# EAGLE design PDM (EAGLE 6.5.0)
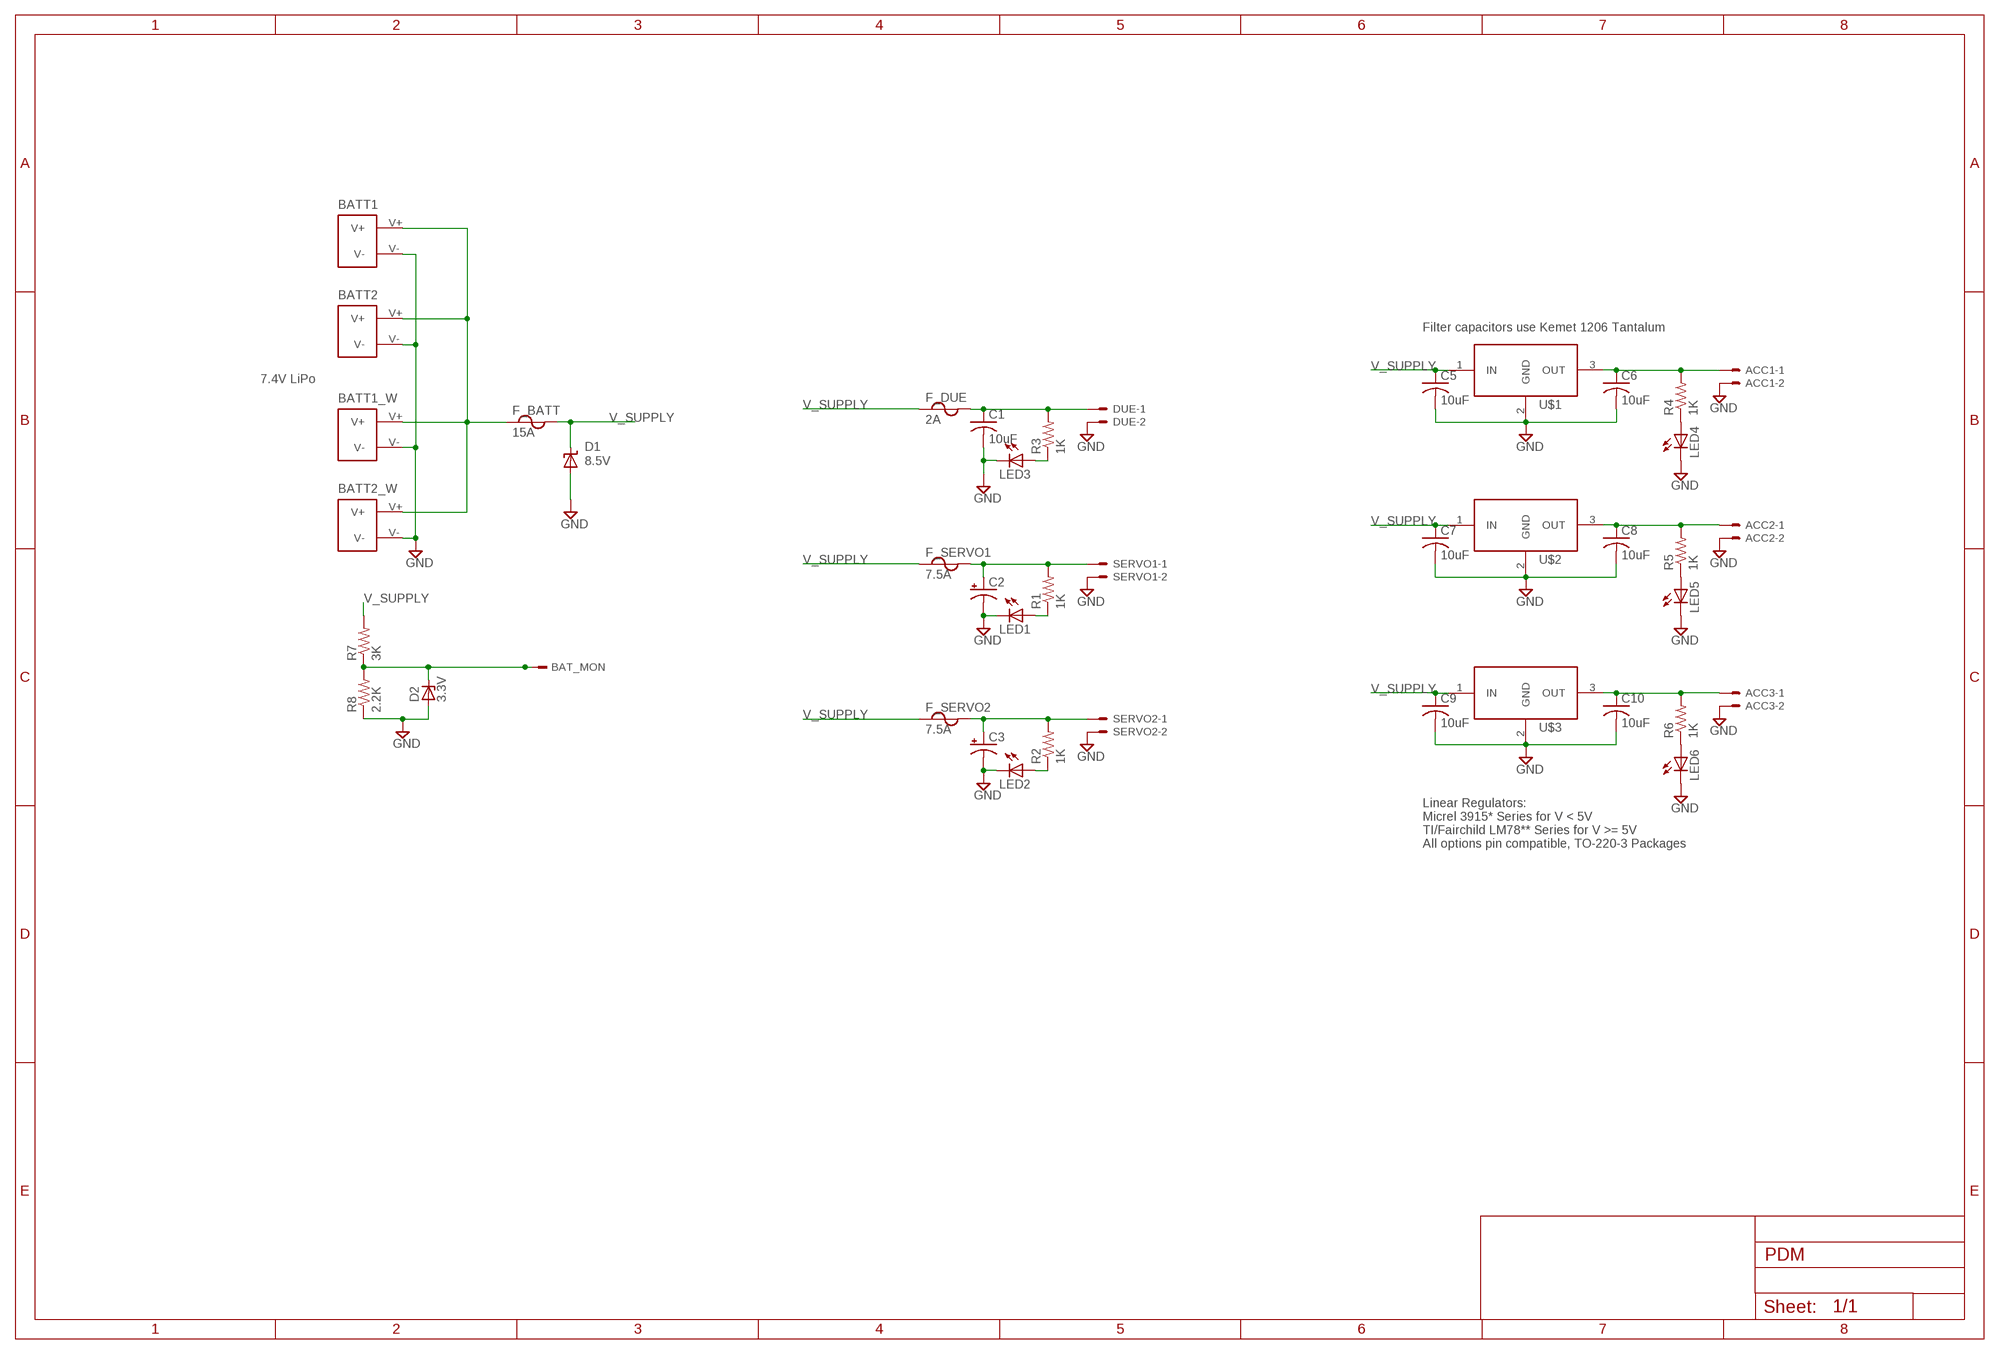
[diagram p0: schematic, sheet 1]

## Parts
ACC1  5566-2  [5566-2]
ACC2  5566-2  [5566-2]
ACC3  5566-2  [5566-2]
BAT_MON  TSW-101-02-S-S  [TSW-101-02-S-S]
BATT1  CON_XT60-PCB_MOUNT  [CON_XT60_PCB_MOUNT]
BATT1_W  CON_XT60-PIGTAIL  [CON_XT60_PIGTAIL]
BATT2  CON_XT60-PCB_MOUNT  [CON_XT60_PCB_MOUNT]
BATT2_W  CON_XT60-PIGTAIL  [CON_XT60_PIGTAIL]
C1  10uF  C-USC1206K  [C1206K]
C2  CPOL-USTT5D11  [TT5D11]
C3  CPOL-USTT5D11  [TT5D11]
C5  10uF  C-USC1206K  [C1206K]
C6  10uF  C-USC1206K  [C1206K]
C7  10uF  C-USC1206K  [C1206K]
C8  10uF  C-USC1206K  [C1206K]
C9  10uF  C-USC1206K  [C1206K]
C10  10uF  C-USC1206K  [C1206K]
D1  8.5V  SUPPRESSOR-SMBJ  [SMBJ]
D2  3.3V  ZENER-DIODESMB  [SMB]
DUE  5566-2  [5566-2]
F_BATT  15A  FUSE-ATO  [ATO]
F_DUE  2A  FUSE-ATO  [ATO]
F_SERVO1  7.5A  FUSE-ATO  [ATO]
F_SERVO2  7.5A  FUSE-ATO  [ATO]
LED1  LEDSML1206  [SML1206]
LED2  LEDSML1206  [SML1206]
LED3  LEDSML1206  [SML1206]
LED4  LEDSML1206  [SML1206]
LED5  LEDSML1206  [SML1206]
LED6  LEDSML1206  [SML1206]
R1  1K  R-US_R1206  [R1206]
R2  1K  R-US_R1206  [R1206]
R3  1K  R-US_R1206  [R1206]
R4  1K  R-US_R1206  [R1206]
R5  1K  R-US_R1206  [R1206]
R6  1K  R-US_R1206  [R1206]
R7  3K  R-US_R1206  [R1206]
R8  2.2K  R-US_R1206  [R1206]
SERVO1  5566-2  [5566-2]
SERVO2  5566-2  [5566-2]
U$1  MIC29150/29300/29500VERTICAL  [TO220V]
U$2  MIC29150/29300/29500VERTICAL  [TO220V]
U$3  MIC29150/29300/29500VERTICAL  [TO220V]

## Nets
GND: ACC1.2 ACC2.2 ACC3.2 BATT1.V- BATT1_W.V- BATT2.V- BATT2_W.V- C1.2 C2.- C3.- C5.2 C6.2 C7.2 C8.2 C9.2 C10.2 D1.A D2.A DUE.2 LED1.C LED2.C LED3.C LED4.C LED5.C LED6.C R8.1 SERVO1.2 SERVO2.2 U$1.2(GND) U$2.2(GND) U$3.2(GND)
N$1: C3.+ F_SERVO2.B1 F_SERVO2.B2 F_SERVO2.B3 F_SERVO2.B4 R2.2 SERVO2.1
N$2: BATT1.V+ BATT1_W.V+ BATT2.V+ BATT2_W.V+ F_BATT.A1 F_BATT.A2 F_BATT.A3 F_BATT.A4
N$4: C1.1 DUE.1 F_DUE.B1 F_DUE.B2 F_DUE.B3 F_DUE.B4 R3.2
N$5: LED1.A R1.1
N$6: ACC1.1 C6.1 R4.2 U$1.3(OUT)
N$8: LED2.A R2.1
N$9: ACC2.1 C8.1 R5.2 U$2.3(OUT)
N$11: LED3.A R3.1
N$13: LED4.A R4.1
N$15: C2.+ F_SERVO1.B1 F_SERVO1.B2 F_SERVO1.B3 F_SERVO1.B4 R1.2 SERVO1.1
N$16: LED5.A R5.1
N$18: BAT_MON.1 D2.C R7.1 R8.2
N$19: ACC3.1 C10.1 R6.2 U$3.3(OUT)
N$22: LED6.A R6.1
V_SUPPLY: C5.1 C7.1 C9.1 D1.C F_BATT.B1 F_BATT.B2 F_BATT.B3 F_BATT.B4 F_DUE.A1 F_DUE.A2 F_DUE.A3 F_DUE.A4 F_SERVO1.A1 F_SERVO1.A2 F_SERVO1.A3 F_SERVO1.A4 F_SERVO2.A1 F_SERVO2.A2 F_SERVO2.A3 F_SERVO2.A4 R7.2 U$1.1(IN) U$2.1(IN) U$3.1(IN)

## Notes on the sheet
- Filter capacitors use Kemet 1206 Tantalum
- 7.4V LiPo
- Linear Regulators:
  Micrel 3915* Series for V < 5V
  TI/Fairchild LM78** Series for V >= 5V
  All options pin compatible, TO-220-3 Packages

## Library data of the parts
ACC1-ACC3 DUE SERVO1 SERVO2 = con-molex:5566-2: Mini FIT connector 2 pol Source: http://www.molex.com; OC_FARNELL: 1822072; OC_NEWARK: unknown
BAT_MON = con-samtec:TSW-101-02-S-S: THROUGH-HOLE .025" SQ POST HEADER Source: Samtec TSW.pdf; OC_FARNELL: unknown; OC_NEWARK: unknown
BATT1 BATT1_W BATT2 BATT2_W = MRSDTeamB:CON_XT60-
C1 C5-C10 = rcl:C-US: CAPACITOR, American symbol
C2 C3 = rcl:CPOL-US: POLARIZED CAPACITOR, American symbol
D1 = MRSDTeamB:SUPPRESSOR-: Suppressor diode
D2 = diode:ZENER-DIODE: Z-Diode
F_BATT F_DUE F_SERVO1 F_SERVO2 = MRSDTeamB:FUSE-: Automotive Fuse, PCB Mount Digikey <http://www.digikey.com/product-detail/en/178.6165.0002/WK6265-ND/653477> Datasheet <http://www.littelfuse.com/data/en/Data_Sheets/Littelfuse_ATO-PCB-Fuse-holders-178.6765.pdf> Library Part by Nate Chapman
LED1-LED6 = led:LED: LED OSRAM: - CHIPLED LG R971, LG N971, LY N971, LG Q971, LY Q971, LO R971, LY R971 LH N974, LH R974 LS Q976, LO Q976, LY Q976 LO Q996 - Hyper CHIPLED LW Q18S LB Q993, LB Q99A, LB R99A - SideLED LS A670, LO A670, LY A670, LG A670, LP A670 LB A673, LV A673, LT A673, LW A673 LH A674 LY A675 LS A676, LA A676, LO A676, LY A676, LW A676 LS A679, LY A679, LG A679 - Hyper Micro SIDELED® LS Y876, LA Y876, LO Y876, LY Y876 LT Y87S - SmartLED LW L88C, LW L88S LB L89C, LB L89S, LG L890 LS L89K, LO L89K, LY L89K LS L896, LA L896, LO L896, LY L896 - TOPLED LS T670, LO T670, LY T670, LG T670, LP T670 LSG T670, LSP T670, LSY T670, LOP T670, LYG T670 LG T671, LOG T671, LSG T671 LB T673, LV T673, LT T673, LW T673 LH T674 LS T676, LA T676, LO T676, LY T676, LB T676, LH T676, LSB T676, LW T676 LB T67C, LV T67C, LT T67C, LS T67K, LO T67K, LY T67K, LW E67C LS E67B, LA E67B, LO E67B, LY E67B, LB E67C, LV E67C, LT E67C LW T67C LS T679, LY T679, LG T679 LS T770, LO T770, LY T770, LG T770, LP T770 LB T773, LV T773, LT T773, LW T773 LH T774 LS E675, LA E675, LY E675, LS T675 LS T776, LA T776, LO T776, LY T776, LB T776 LHGB T686 LT T68C, LB T68C - Hyper Mini TOPLED® LB M676 - Mini TOPLED Santana® LG M470 LS M47K, LO M47K, LY M47K Source: http://www.osram.convergy.de LUXEON: - LUMILED® LXK2-PW12-R00, LXK2-PW12-S00, LXK2-PW14-U00, LXK2-PW14-V00 LXK2-PM12-R00, LXK2-PM12-S00, LXK2-PM14-U00 LXK2-PE12-Q00, LXK2-PE12-R00, LXK2-PE12-S00, LXK2-PE14-T00, LXK2-PE14-U00 LXK2-PB12-K00, LXK2-PB12-L00, LXK2-PB12-M00, LXK2-PB14-N00, LXK2-PB14-P00, LXK2-PB14-Q00 LXK2-PR12-L00, LXK2-PR12-M00, LXK2-PR14-Q00, LXK2-PR14-R00 LXK2-PD12-Q00, LXK2-PD12-R00, LXK2-PD12-S00 LXK2-PH12-R00, LXK2-PH12-S00 LXK2-PL12-P00, LXK2-PL12-Q00, LXK2-PL12-R00 Source: www.luxeon.com KINGBRIGHT: KA-3528ASYC Source: www.kingbright.com
R1-R8 = rcl:R-US_: RESISTOR, American symbol
U$1-U$3 = MRSDTeamB:MIC29150/29300/29500

## Board
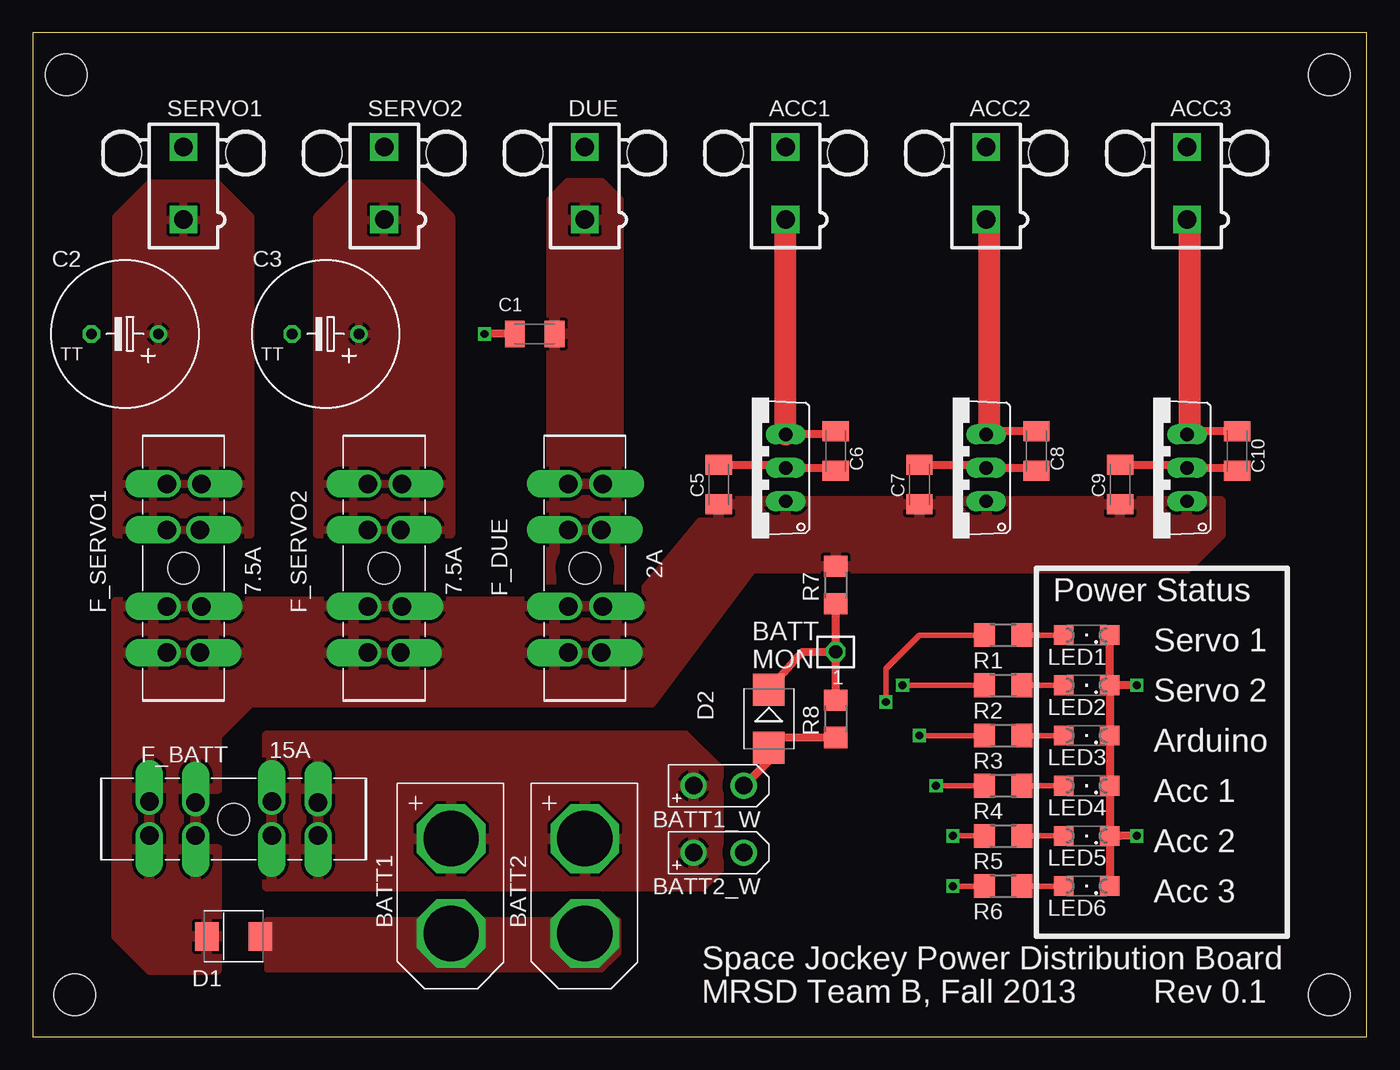
[diagram p1: board, top side]
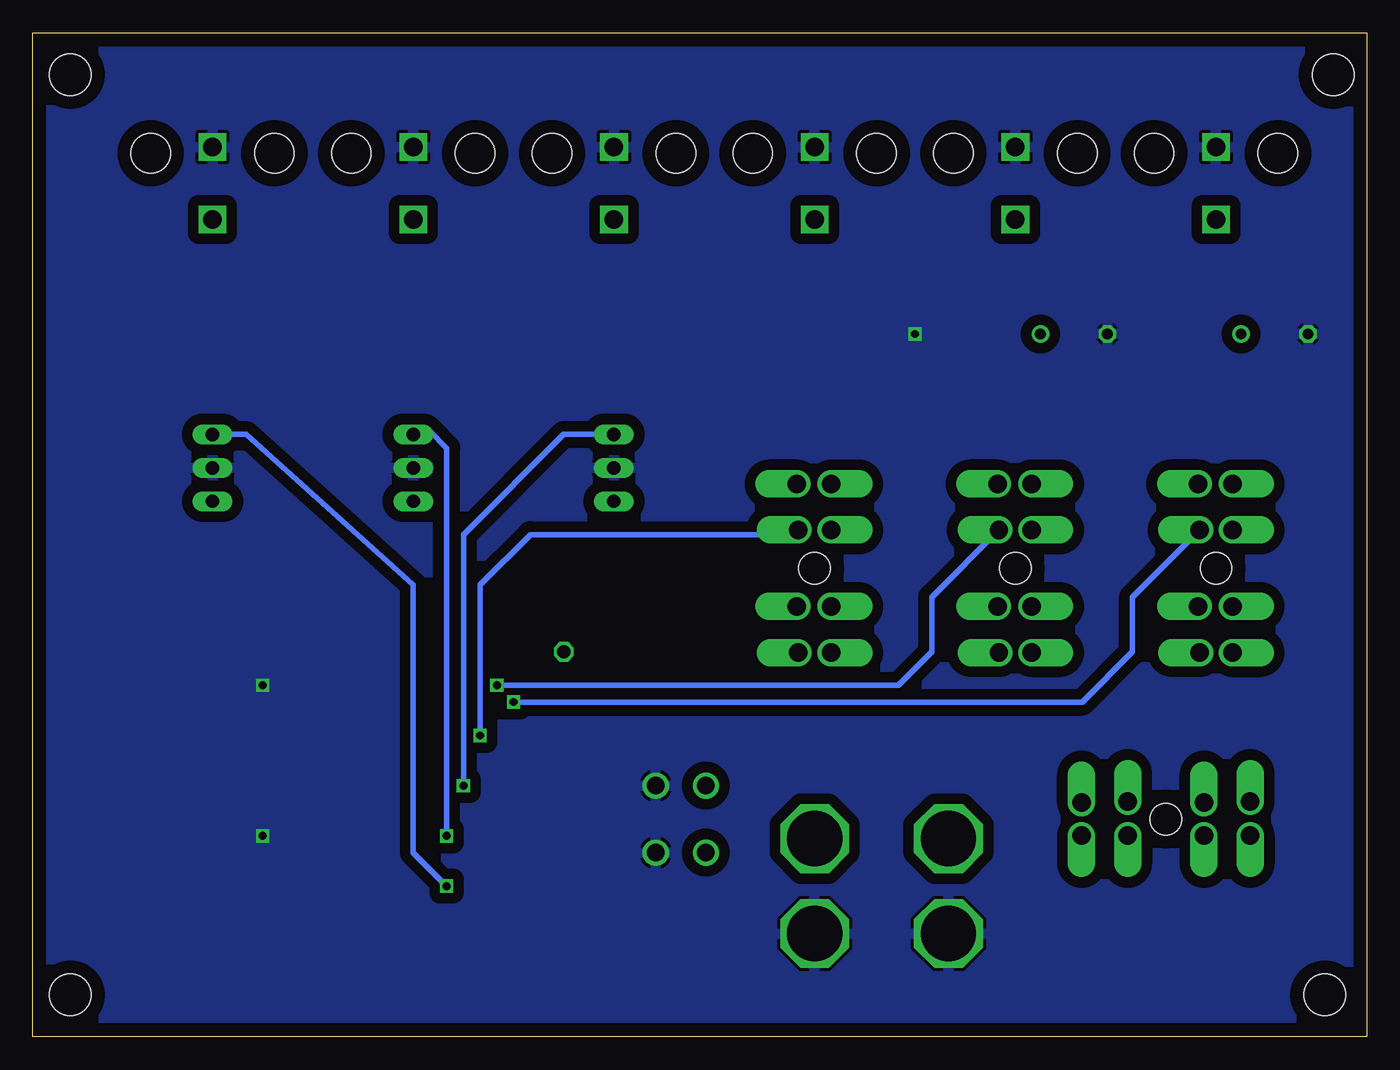
[diagram p2: board, bottom side, seen from below]

Size 101.27 x 76.19 mm. Coordinates in mm from the lower left corner, seen from the top.
Outline: 0,0 101.27,0 101.27,76.19 0,76.19 0,0
Copper layers (1*16): Top 0.035mm / dielectric 1.5mm / Bottom 0.035mm
Design rules "default *": minimum track width 10mil, minimum drill 16mil, track to track 8mil, track to pad 8mil, pad to pad 8mil, via to via 8mil, smd to smd 8mil, copper to edge 40mil, drill to drill 8mil, minimum pad ring 10mil, minimum via ring 8mil, stop-mask expansion 4mil, vias tented up to drill 0mil, thermal gap 10mil
Holes 3.17 mm at 3.17,3.17 98.42,3.17 2.54,73.03 98.42,73.03

### Footprints (pad centres in the part's own frame; a part is rotated, then mirrored left to right if it is on the bottom)
5566-2 = drill 1.4 square: 1 0,-2.75; 2 0,2.75 | hole 3: 4.7,2.29; -4.7,2.29
TSW-101-02-S-S = drill 1 pad 1.5 octagon: 1 0,0
CON_XT60_PCB_MOUNT = drill 4.2 octagon: V+ 3.6,0; V- -3.6,0
CON_XT60_PIGTAIL = drill 1.321: V+ 1.905,0; V- -1.905,0
C1206K = smd 1.5 x 2: 1 -1.5,0; 2 1.5,0
TT5D11 = drill 0.813: + -2.54,0 | drill 0.813 octagon: - 2.54,0
SMBJ = smd 1.78 x 2.16: A 2.04,0; C -2.03,0
SMB = smd 2.4 x 2.4: A 2.2,0; C -2.2,0
ATO = drill 1.4 offset: A1 -6.4,1.25; A2 -2.9,1.25; A3 -6.4,-1.25; A4 -2.9,-1.35; B1 2.9,1.25; B2 6.4,1.25; B3 2.9,-1.25; B4 6.4,-1.35 | hole 2.4: 0,0
SML1206 = smd 1.5 x 1.5: A 1.75,0; C -1.75,0
R1206 = smd 1.6 x 1.803: 1 -1.422,0; 2 1.422,0
TO220V = drill 1.016 long: 1 -2.54,-2.54; 2 0,-2.54; 3 2.54,-2.54

### Placement (x,y rotation side)
ACC1  57.15,64.77 0 top
ACC2  72.39,64.77 0 top
ACC3  87.63,64.77 0 top
BAT_MON  60.96,29.21 0 top
BATT1  31.75,11.43 90 top
BATT1_W  52.07,19.05 180 top
BATT2  41.91,11.43 90 top
BATT2_W  52.07,13.97 180 top
C1  38.1,53.34 180 top
C2  6.99,53.34 180 top
C3  22.23,53.34 180 top
C5  52.07,41.91 90 top
C6  60.96,44.45 270 top
C7  67.31,41.91 90 top
C8  76.2,44.45 270 top
C9  82.55,41.91 90 top
C10  91.44,44.45 270 top
D1  15.24,7.62 0 top
D2  55.88,24.13 270 top
DUE  41.91,64.77 0 top
F_BATT  15.24,16.51 180 top
F_DUE  41.91,35.56 90 top
F_SERVO1  11.43,35.56 90 top
F_SERVO2  26.67,35.56 90 top
LED1  80.01,30.48 180 top
LED2  80.01,26.67 180 top
LED3  80.01,22.86 180 top
LED4  80.01,19.05 180 top
LED5  80.01,15.24 180 top
LED6  80.01,11.43 180 top
R1  73.66,30.48 180 top
R2  73.66,26.67 180 top
R3  73.66,22.86 180 top
R4  73.66,19.05 180 top
R5  73.66,15.24 180 top
R6  73.66,11.43 180 top
R7  60.96,34.29 90 top
R8  60.96,24.13 90 top
SERVO1  11.43,64.77 0 top
SERVO2  26.67,64.77 0 top
U$1  54.61,43.18 90 top
U$2  69.85,43.18 90 top
U$3  85.09,43.18 90 top

### Tracks (layer width: path | path; a pad name or v marks a point on that pad's centre or on a via)
GND  (via drill 0.6)
  Top 0.406: 57.15,43.41 U$1.2
  Top 0.61: C5.2 57.15,43.41 | U$1.2 60.96,43.18 C6.2 | C7.2 72.39,43.41 U$2.2 76.2,43.18 C8.2 | C9.2 87.63,43.41 U$3.2 91.44,43.18 C10.2 | R8.1 55.88,22.71 D2.A 55.88,20.95 BATT1_W.V- | C1.2 v34.29,53.34 | v83.82,26.67 LED2.C | LED2.C LED1.C | LED2.C LED3.C LED4.C LED5.C LED6.C | v83.82,15.24 82.55,15.24
  pour Bottom (isolate 0.813): 0.64,75.56 100.33,75.56 100.33,1.27 1.27,1.27
  pour Top (isolate 1.27, no thermals): 17.78,8.89 44.45,8.89 44.45,6.35 43.18,5.08 17.78,5.08
N$1  (via drill 0.6)
  Top 0.406: R2.2 v66.04,26.67
  Bottom 0.406: v66.04,26.67 35.56,26.67 33.02,29.21 33.02,33.36 F_SERVO2.B3
  pour Top (isolate 0.61): 21.59,38.1 21.59,62.23 24.13,64.77 29.21,64.77 31.75,62.23 31.75,38.1
N$2
  pour Top (isolate 0.61): 17.78,11.43 17.78,22.86 49.53,22.86 52.07,20.32 52.07,12.7 50.8,11.43
N$4  (via drill 0.6)
  Top 0.406: R3.2 v67.31,22.86
  Bottom 0.406: v67.31,22.86 67.31,34.29 63.5,38.1 43.52,38.1 F_DUE.B3
  pour Top (isolate 0.61): 39.37,34.29 39.37,63.5 40.64,64.77 43.18,64.77 44.45,63.5 44.45,34.29
N$5
  Top 0.406: R1.1 LED1.A
N$6  (via drill 0.6)
  Top 0.406: R4.2 v68.58,19.05
  Top 0.61: C6.1 60.96,45.72 U$1.3
  Top 1.676: U$1.3 ACC1.1
  Bottom 0.406: v68.58,19.05 68.58,38.1 60.96,45.72 U$1.3
N$8
  Top 0.406: R2.1 LED2.A
N$9  (via drill 0.6)
  Top 0.406: R5.2 v69.85,15.24
  Top 0.61: C8.1 72.62,45.95 U$2.3
  Top 1.676: 72.62,45.95 72.62,61.79 ACC2.1
  Bottom 0.406: v69.85,15.24 69.85,44.68 71.12,45.95 72.62,45.95 U$2.3
N$11
  Top 0.406: R3.1 LED3.A
N$13
  Top 0.406: R4.1 LED4.A
N$15  (via drill 0.6)
  Top 0.406: R1.2 67.31,30.48 64.77,27.94 v64.77,25.4
  Bottom 0.406: v64.77,25.4 21.59,25.4 17.78,29.21 17.78,33.36 F_SERVO1.B3
  pour Top (isolate 0.61): 16.51,38.1 6.35,38.1 6.35,62.23 8.89,64.77 13.97,64.77 16.51,62.23
N$16
  Top 0.406: R5.1 LED5.A
N$18
  Top 0.61: R8.2 BAT_MON.1 | BAT_MON.1 R7.1 | D2.C 58.42,29.21 BAT_MON.1
N$19  (via drill 0.6)
  Top 0.406: v69.85,11.43 R6.2
  Top 0.61: C10.1 87.86,45.95 U$3.3
  Top 1.676: 87.86,45.95 87.86,61.79 ACC3.1
  Bottom 0.406: U$3.3 85.09,45.72 72.39,34.29 72.39,13.97 v69.85,11.43
N$22
  Top 0.406: R6.1 LED6.A
V_SUPPLY
  pour Top (isolate 0.61): 13.97,22.86 13.97,5.08 8.89,5.08 6.35,7.62 6.35,33.02 45.72,33.02 52.07,40.64 90.17,40.64 90.17,38.1 87.63,35.56 54.61,35.56 46.99,25.4 16.51,25.4

### Text on the board
tPlace: Servo 1 | Servo 2 | Arduino | Acc 1 | Acc 2 | Acc 3
tNames: Power Status | BATT / MON | Space Jockey Power Distribution Board | MRSD Team B, Fall 2013 | Rev 0.1